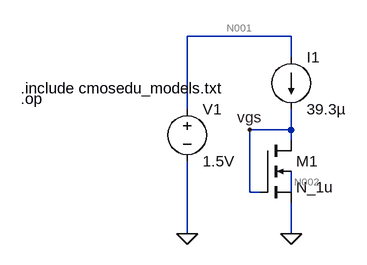
[diagram p0: schematic Circuito-2.asc]
Circuito-2.asc, the LTspice schematic file:
Version 4
SHEET 1 880 680
WIRE 176 -80 16 -80
WIRE 176 -48 176 -80
WIRE 16 32 16 -80
WIRE 176 64 176 32
WIRE 176 64 112 64
WIRE 176 80 176 64
WIRE 112 160 112 64
WIRE 128 160 112 160
WIRE 176 160 176 128
WIRE 16 224 16 112
WIRE 176 224 176 176
FLAG 16 224 0
FLAG 176 224 0
FLAG 112 64 vgs
SYMBOL voltage 16 16 R0
WINDOW 123 0 0 Left 2
WINDOW 39 0 0 Left 2
SYMATTR InstName V1
SYMATTR Value 1.5V
SYMBOL nmos4 128 80 R0
SYMATTR InstName M1
SYMATTR Value N_1u
SYMATTR Value2 l=1.5u w=3u
SYMBOL current 176 -48 R0
WINDOW 123 0 0 Left 2
WINDOW 39 0 0 Left 2
SYMATTR InstName I1
SYMATTR Value 39.3µ
TEXT -240 0 Left 2 !.include cmosedu_models.txt
TEXT -240 16 Left 2 !.op

The netlist it stands for:
* Circuito-2.asc
V1 N001 0 1.5V
M1 vgs vgs 0 N002 N_1u l=1.5u w=3u
I1 N001 vgs 39.3µ
.model NMOS NMOS
.model PMOS PMOS
.lib standard.mos
.include cmosedu_models.txt
.op
.backanno
.end

* Results of the author's LTspice run, read from the files saved beside the schematic
* Operating Point:
*   V(n001) = 1.5 V
*   V(vgs) = 1.464 V
*   V(n002) = 124.6 mV
*   Id(M1) = 39.3 µA
*   Ig(M1) = 0 A
*   Ib(M1) = 0 A
*   Is(M1) = -39.3 µA
*   I(I1) = 39.3 µA
*   I(V1) = -39.3 µA
* From the log:
*   Semiconductor Device Operating Points:
*                           --- MOSFET Transistors ---
*   Name:          m1
*   Model:        n_1u
*   Id:          3.93e-05
*   Vgs:         1.46e+00
*   Vds:         1.46e+00
*   Vbs:         1.25e-01
*   Vth:         8.51e-01
*   Vdsat:       4.72e-01
*   Gm:          1.01e-04
*   Gds:         4.28e-06
*   Gmb:         3.03e-05
*   Cbd:         0.00e+00
*   Cbs:         0.00e+00
*   Cgsov:       6.00e-16
*   Cgdov:       6.00e-16
*   Cgbov:       1.30e-16
*   Cgs:         4.49e-15
*   Cgd:         0.00e+00
*   Cgb:         0.00e+00